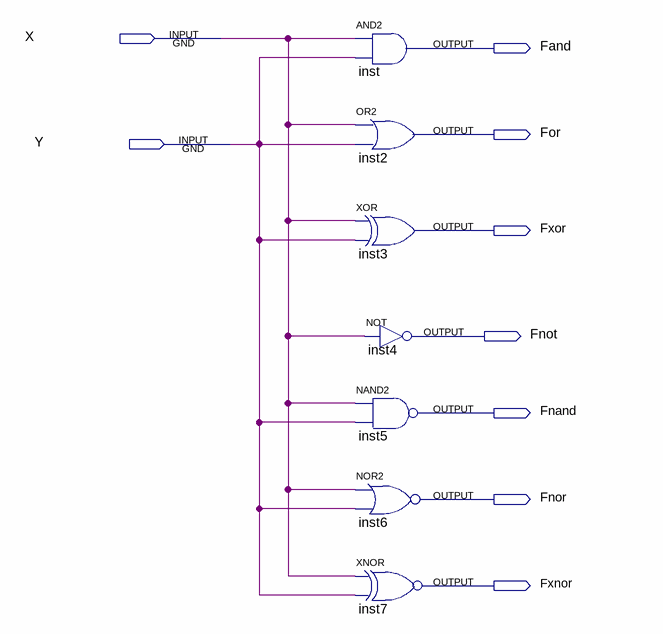
[diagram p0: schematic sheet]
// Quartus schematic logicgates.bdf as structural Verilog: 7 symbols, 9 pins
module logicgates (
  input  X,
  input  Y,
  output Fand,
  output For,
  output Fxor,
  output Fnot,
  output Fnand,
  output Fnor,
  output Fxnor
);

  and inst (Fand, X, Y);
  or inst2 (For, X, Y);
  xor inst3 (Fxor, X, Y);
  not inst4 (Fnot, X);
  nand inst5 (Fnand, X, Y);
  nor inst6 (Fnor, X, Y);
  xnor inst7 (Fxnor, X, Y);
endmodule
